# Altium schematic sheet 16_40PIN_Connector.SchDoc
size 297 x 209 mm
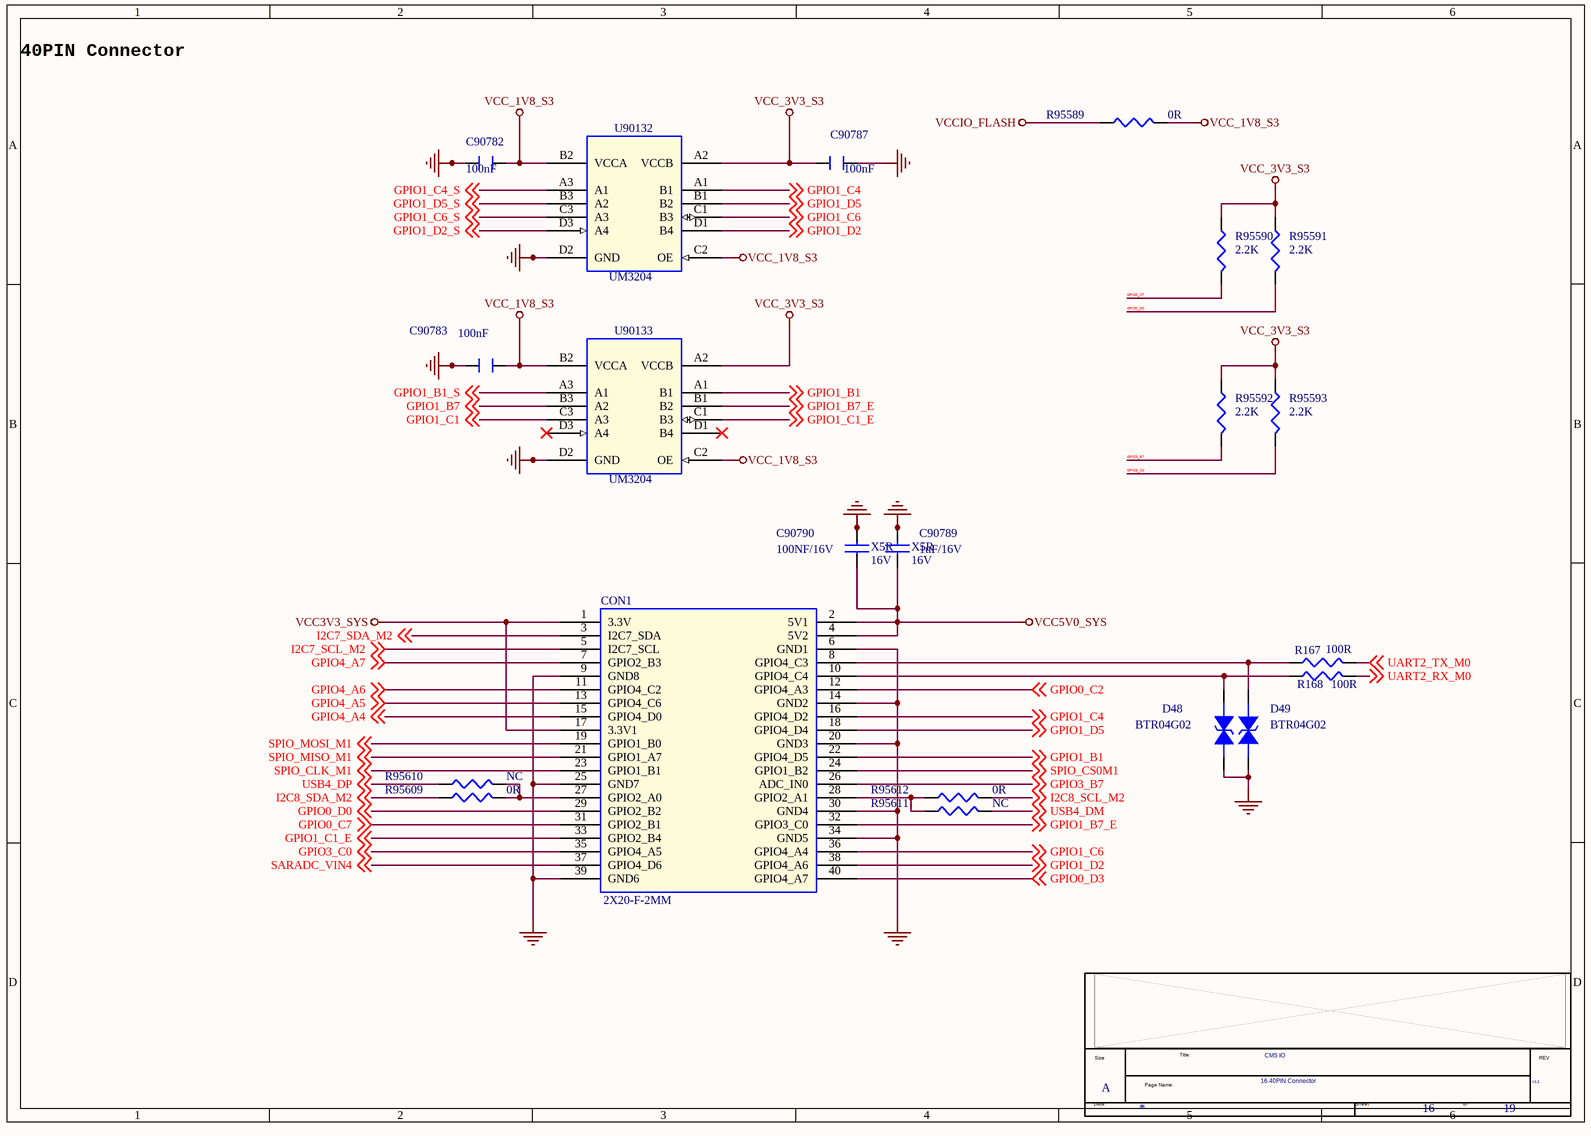
[diagram p0: 16_40PIN_Connector.SchDoc]

## Parts
*  Doc: 16.40PIN Connector  RevCode: V2.2  Title: CM5 IO  Page Size: A  Page Number: 16  Page Count: 19  (hidden comment: radxa_1010)  (graphical)
C90782  100nF  [C0402]
C90783  100nF  [C0402]
C90787  100nF  [C0402]
C90789  1uF/16V  Voltage: 16V  Dielectric: X5R  [C0402]
C90790  100NF/16V  Voltage: 16V  Dielectric: X5R  [C0402]
CON1  2X20-F-2MM  [DIP40PIN_2D54MM]
D48  BTR04G02  [ESD0402_1XD5]
D49  BTR04G02  [ESD0402_1XD5]
R167  100R  [R0402]
R168  100R  [R0402]
R95589  0R  [R0402]
R95590  2.2K  [R0402]
R95591  2.2K  [R0402]
R95592  2.2K  [R0402]
R95593  2.2K  [R0402]
R95609  0R  [R0402]
R95610  NC  [R0402]
R95611  NC  [R0402]
R95612  0R  [R0402]
U90132  UM3204  [CSP-12]
U90133  UM3204  [CSP-12]

## Nets
GND: C90782.1 C90783.1 C90787.1 C90789.2 C90790.2 CON1.6(GND1) CON1.9(GND8) CON1.14(GND2) CON1.20(GND3) CON1.25(GND7) CON1.30(GND4) CON1.34(GND5) CON1.39(GND6) D48.1 D49.1 U90132.D2(GND) U90133.D2(GND)
VCC3V3_SYS: CON1.1(3.3V) CON1.17(3.3V1)
VCC5V0_SYS: C90789.1 C90790.1 CON1.2(5V1) CON1.4(5V2)
VCC_1V8_S3: C90782.2 C90783.2 R95589.2 U90132.B2(VCCA) U90132.C2(OE) U90133.B2(VCCA) U90133.C2(OE)
VCC_3V3_S3: C90787.2 R95590.1 R95591.1 R95592.1 R95593.1 U90132.A2(VCCB) U90133.A2(VCCB)
VCCIO_FLASH: R95589.1
GPIO0_C2: CON1.12(GPIO4_A3) ; off-sheet GPIO0_C2
GPIO0_C7: CON1.31(GPIO2_B1) R95590.2 ; off-sheet GPIO0_C7
GPIO0_D0: CON1.29(GPIO2_B2) R95591.2 ; off-sheet GPIO0_D0
GPIO0_D3: CON1.40(GPIO4_A7) ; off-sheet GPIO0_D3
GPIO1_B1: CON1.22(GPIO4_D5) U90133.A1(B1) ; off-sheet GPIO1_B1
GPIO1_B1_S: U90133.A3(A1) ; off-sheet GPIO1_B1_S
GPIO1_B7: U90133.B3(A2) ; off-sheet GPIO1_B7
GPIO1_B7_E: CON1.32(GPIO3_C0) U90133.B1(B2) ; off-sheet GPIO1_B7_E
GPIO1_C1: U90133.C3(A3) ; off-sheet GPIO1_C1
GPIO1_C1_E: CON1.33(GPIO2_B4) U90133.C1(B3) ; off-sheet GPIO1_C1_E
GPIO1_C4: CON1.16(GPIO4_D2) U90132.A1(B1) ; off-sheet GPIO1_C4
GPIO1_C4_S: U90132.A3(A1) ; off-sheet GPIO1_C4_S
GPIO1_C6: CON1.36(GPIO4_A4) U90132.C1(B3) ; off-sheet GPIO1_C6
GPIO1_C6_S: U90132.C3(A3) ; off-sheet GPIO1_C6_S
GPIO1_D2: CON1.38(GPIO4_A6) U90132.D1(B4) ; off-sheet GPIO1_D2
GPIO1_D2_S: U90132.D3(A4) ; off-sheet GPIO1_D2_S
GPIO1_D5: CON1.18(GPIO4_D4) U90132.B1(B2) ; off-sheet GPIO1_D5
GPIO1_D5_S: U90132.B3(A2) ; off-sheet GPIO1_D5_S
GPIO3_B7: CON1.26(ADC_IN0) R95592.2 ; off-sheet GPIO3_B7
GPIO3_C0: CON1.35(GPIO4_A5) R95593.2 ; off-sheet GPIO3_C0
GPIO4_A4: CON1.15(GPIO4_D0) ; off-sheet GPIO4_A4
GPIO4_A5: CON1.13(GPIO4_C6) ; off-sheet GPIO4_A5
GPIO4_A6: CON1.11(GPIO4_C2) ; off-sheet GPIO4_A6
GPIO4_A7: CON1.7(GPIO2_B3) ; off-sheet GPIO4_A7
I2C7_SCL_M2: CON1.5(I2C7_SCL) ; off-sheet I2C7_SCL_M2
I2C7_SDA_M2: CON1.3(I2C7_SDA) ; off-sheet I2C7_SDA_M2
I2C8_SCL_M2: R95612.2 ; off-sheet I2C8_SCL_M2
I2C8_SDA_M2: R95609.1 ; off-sheet I2C8_SDA_M2
SARADC_VIN4: CON1.37(GPIO4_D6) ; off-sheet SARADC_VIN4
SPIO_CLK_M1: CON1.23(GPIO1_B1) ; off-sheet SPIO_CLK_M1
SPIO_CS0M1: CON1.24(GPIO1_B2) ; off-sheet SPIO_CS0M1
SPIO_MISO_M1: CON1.21(GPIO1_A7) ; off-sheet SPIO_MISO_M1
SPIO_MOSI_M1: CON1.19(GPIO1_B0) ; off-sheet SPIO_MOSI_M1
UART2_RX_M0: R168.2 ; off-sheet UART2_RX_M0
UART2_TX_M0: R167.2 ; off-sheet UART2_TX_M0
USB4_DM: R95611.2 ; off-sheet USB4_DM
USB4_DP: R95610.1 ; off-sheet USB4_DP
NetCON1_8: CON1.8(GPIO4_C3) D49.2 R167.1
NetCON1_10: CON1.10(GPIO4_C4) D48.2 R168.1
NetCON1_27: CON1.27(GPIO2_A0) R95609.2 R95610.2
NetCON1_28: CON1.28(GPIO2_A1) R95611.1 R95612.1

Not connected (* = marked no-connect by the designer): U90133 D1(B4)* D3(A4)*

## Notes on the sheet
- 40PIN Connector
- (in symbol radxa_1010) Size; Title:; REV; Page Name:; Date:; Sheet; of

## Library data of the parts
C90782 C90783 C90787 = CAPACITOR_0: PAGE: 1; PCB Footprint: C0402
C90789 = CAP NP_0: cap,1.00uF,+/-10%,16V,X5R,C0402; Manufacturer PN: C1005X5R1C105K050BC; Manufacturer: TDK; Tolerance: 10%; Priority: A; PCB Footprint: C0402; Created by: JJJ; Part Type: C0402; RK PN: C1005X5R1C105K050BC
C90790 = CAP NP_0: cap,100.00nF,+/-10%,16V,X5R,C0402; Manufacturer: TDK; RK PN: C1005X5R1C104K050BA; Priority: A; Tolerance: 10%; PCB Footprint: C0402; Part Type: C0402; Manufacturer PN: C1005X5R1C104K050BA; Created by: JJJ
CON1 = CN_0_Dup1: PCB Footprint: DIP40PIN_2D54MM
D48 = DIODE BI_DIR TRIG_2: 1-Line, Bi-directional, Transient Voltage Suppressors.17.5pF.; Manufacturer PN: ESD5451N; Manufacturer: WillSemi(韦尔半导体); OPTION: DNP; Priority: A; PCB Footprint: ESD0402_1XD5; Created by: JJJ; Part Type: ESD_TVS; RK PN: ESD5451N
D49 = DIODE BI_DIR TRIG_2: 1-Line, Bi-directional, Transient Voltage Suppressors.17.5pF.; Manufacturer: WillSemi(韦尔半导体); RK PN: ESD5451N; Priority: A; OPTION: DNP; PCB Footprint: ESD0402_1XD5; Part Type: ESD_TVS; Manufacturer PN: ESD5451N; Created by: JJJ
R167 = RESISTOR_0_Dup3: 通用厚膜电阻,100R,+/-5%,R0402,1/16W.; Manufacturer: YAGEO; Tolerance: 5%; RK PN: RC0402JR-07100RL; Priority: A; Wattage: 1/16W; PCB Footprint: R0402; Part Type: 通用厚膜电阻; Manufacturer PN: RC0402JR-07100RL; Created by: YTL
R168 = RESISTOR_0_Dup3: 通用厚膜电阻,100R,+/-5%,R0402,1/16W.; Manufacturer PN: RC0402JR-07100RL; Manufacturer: YAGEO; Tolerance: 5%; Wattage: 1/16W; Priority: A; PCB Footprint: R0402; Created by: YTL; Part Type: 通用厚膜电阻; RK PN: RC0402JR-07100RL
R95589 R95591 R95592 R95610 R95611 = RESISTOR_3: 通用厚膜电阻,2K2,+/-5%,R0402,1/16W.; Manufacturer: YAGEO; Tolerance: 5%; RK PN: RC0402JR-072K2L; Priority: A; Wattage: 1/16W; PCB Footprint: R0402; Part Type: 通用厚膜电阻; Manufacturer PN: RC0402JR-072K2L; Created by: YTL
R95590 R95593 R95609 R95612 = RESISTOR_3: 通用厚膜电阻,2K2,+/-5%,R0402,1/16W.; Manufacturer PN: RC0402JR-072K2L; Manufacturer: YAGEO; Tolerance: 5%; Wattage: 1/16W; Priority: A; PCB Footprint: R0402; Created by: YTL; Part Type: 通用厚膜电阻; RK PN: RC0402JR-072K2L
U90132 U90133 = MP2610_0: 4-bit Bi-directional Level Shifter  UM3204H; Part Number: PI4ULS5V104GAEX; Vendor: PERICOM; PCB Footprint: CSP-12
* = radxa_1010: Page Create Date: March  8, 1995; Page Modify Date: *